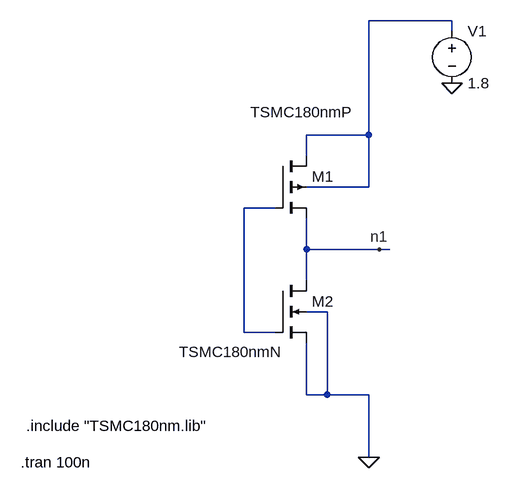
[diagram p0: schematic Inverter.asc]
Inverter.asc, the LTspice schematic file:
Version 4.1
SHEET 1 880 680
WIRE 448 -208 320 -208
WIRE 448 -192 448 -208
WIRE 320 -32 320 -208
WIRE 320 -32 224 -32
WIRE 224 0 224 -32
WIRE 320 48 320 -32
WIRE 320 48 224 48
WIRE 176 80 128 80
WIRE 224 144 224 96
WIRE 336 144 224 144
WIRE 352 144 336 144
WIRE 224 192 224 144
WIRE 256 240 224 240
WIRE 128 272 128 80
WIRE 176 272 128 272
WIRE 224 368 224 288
WIRE 256 368 256 240
WIRE 256 368 224 368
WIRE 320 368 256 368
WIRE 320 464 320 368
FLAG 336 144 n1
FLAG 320 464 0
FLAG 448 -112 0
SYMBOL pmos4 176 0 R0
WINDOW 3 -38 -67 Left 2
SYMATTR Value TSMC180nmP
SYMATTR InstName M1
SYMATTR Value2 l=180n w=2u
SYMBOL nmos4 176 192 R0
WINDOW 3 -148 110 Left 2
SYMATTR Value TSMC180nmN
SYMATTR InstName M2
SYMATTR Value2 l=180n w=1u
SYMBOL voltage 448 -208 R0
WINDOW 123 0 0 Left 0
WINDOW 39 0 0 Left 0
SYMATTR InstName V1
SYMATTR Value 1.8
TEXT -208 416 Left 2 !.include "TSMC180nm.lib"
TEXT -216 472 Left 2 !.tran 100n

The netlist it stands for:
* Inverter.asc
M1 N001 N002 n1 N001 TSMC180nmP l=180n w=2u
M2 n1 N002 0 0 TSMC180nmN l=180n w=1u
V1 N001 0 1.8
.model NMOS NMOS
.model PMOS PMOS
.lib standard.mos
.include "TSMC180nm.lib"
.tran 100n
.backanno
.end